# EAGLE schematic BE_SHIELD (EAGLE 6.3)

## Sheet 1 of 5
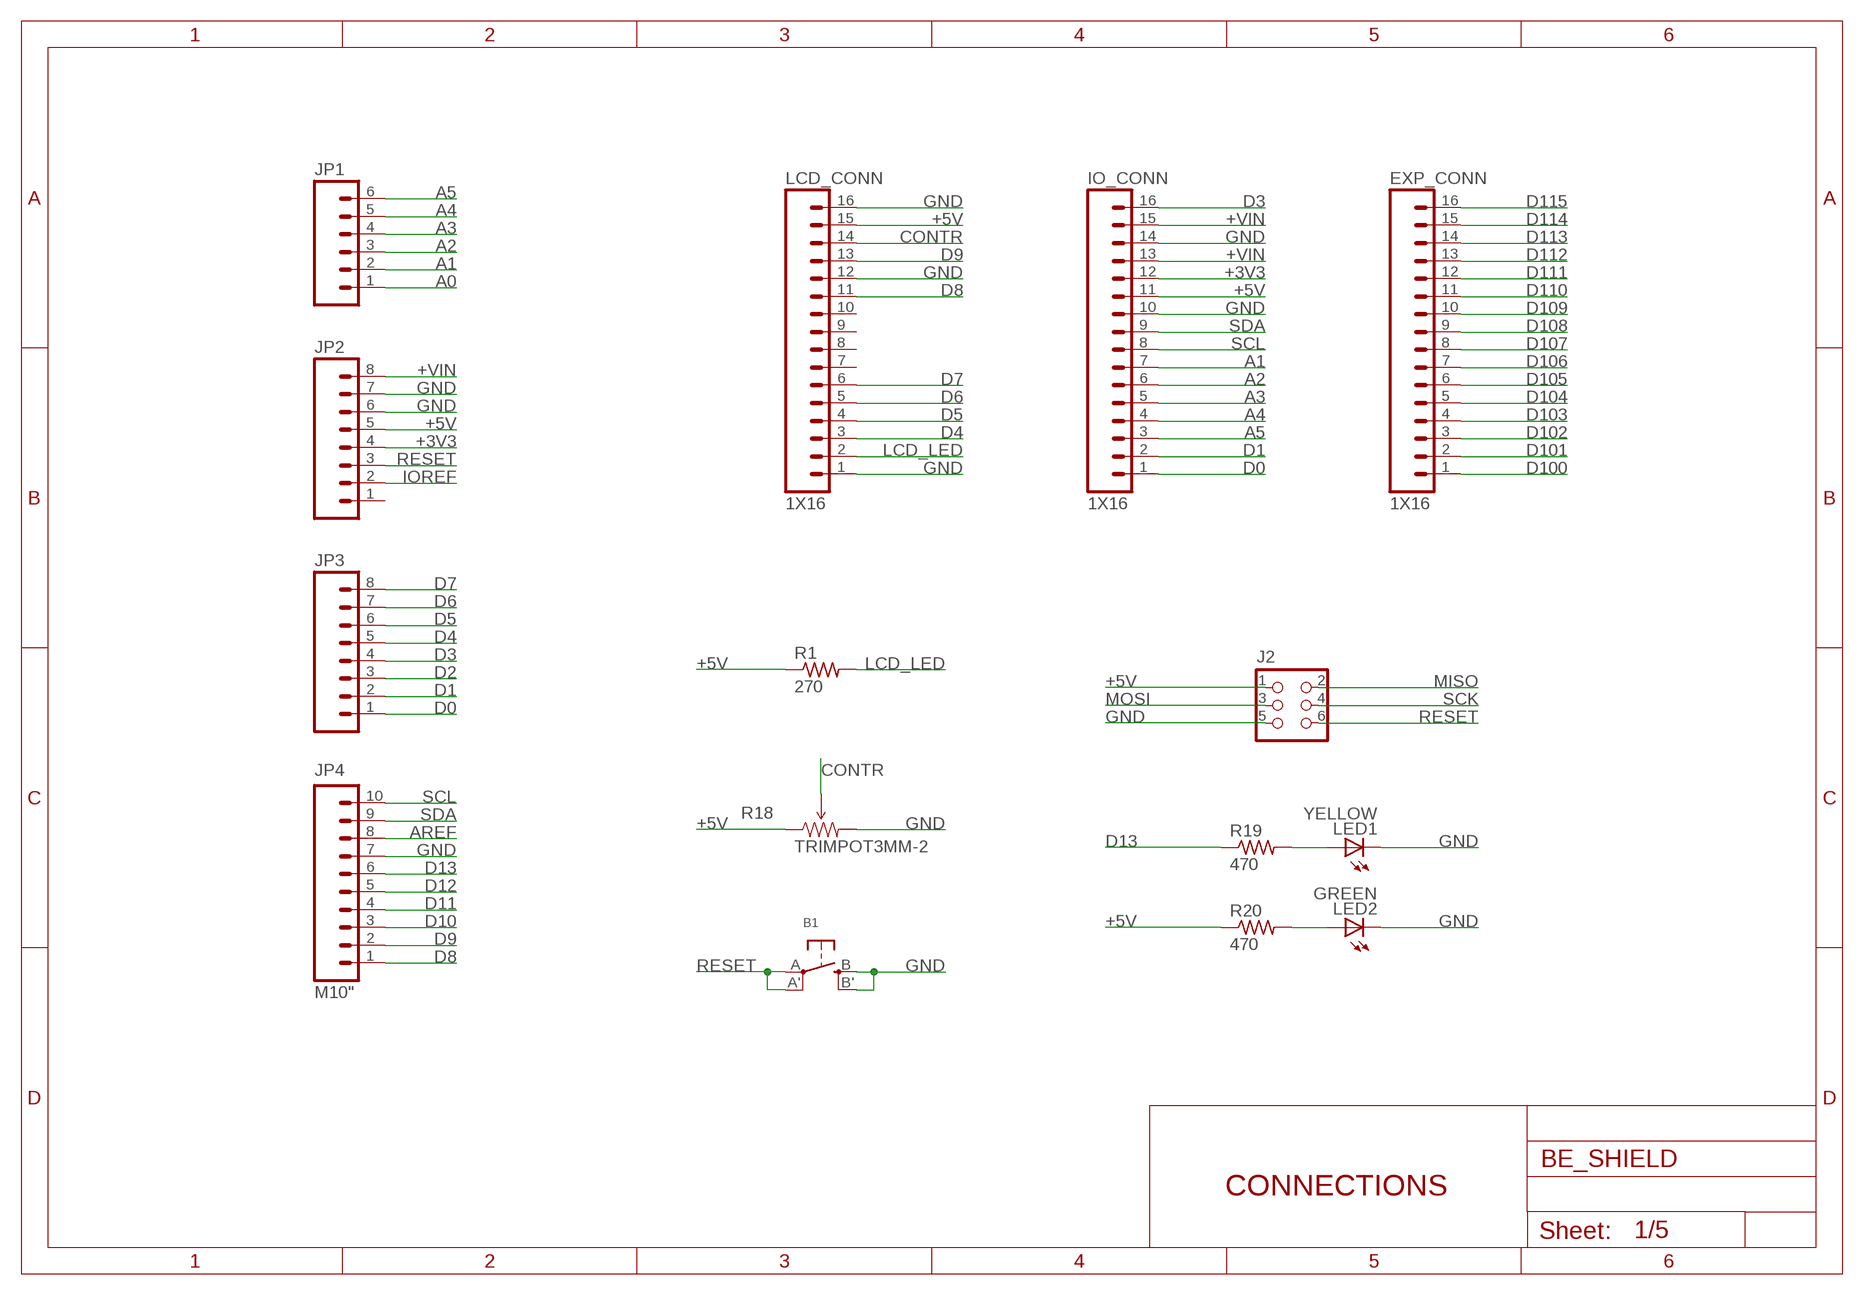
[diagram p0: schematic, sheet 1]

### Parts
B1  SWITCH_TACT_SMT  [EVQ-Q2]
EXP_CONN  1X16  [1X16_SMD]
IO_CONN  1X16  [1X16_SMD]
J2  CON_HEADER_2X03-SMD  [M2X3_SMD]
JP1  M06SIP  [1X06]
JP2  M081X08  [1X08]
JP3  M081X08  [1X08]
JP4  M10"  [1X10]
LCD_CONN  1X16  [1X16_SMD]
LED1  YELLOW  LEDCHIP-LED0805  [CHIP-LED0805]
LED2  GREEN  LEDCHIP-LED0805  [CHIP-LED0805]
R1  270  R-US_R0603  [R0603]
R18  TRIMPOT3MM-2  [TRIMPOT-3MM-2]
R19  470  R-US_R0603  [R0603]
R20  470  R-US_R0603  [R0603]

### Nets
+3V3: IO_CONN.12 JP2.4 ; also sheet 2,3,4
+5V [power]: IO_CONN.11 J2.1 JP2.5 LCD_CONN.15 R1.1 R18.1(CCW) R20.1 ; also sheet 2,4
+VIN: IO_CONN.13 IO_CONN.15 JP2.8 ; also sheet 5
A0: JP1.1 ; also sheet 2
A1: IO_CONN.7 JP1.2
A2: IO_CONN.6 JP1.3
A3: IO_CONN.5 JP1.4
A4: IO_CONN.4 JP1.5
A5: IO_CONN.3 JP1.6
AREF: JP4.8
CONTR: LCD_CONN.14 R18.2(WIPER)
D0: IO_CONN.1 JP3.1
D1: IO_CONN.2 JP3.2
D2: JP3.3 ; also sheet 2
D3: IO_CONN.16 JP3.4
D4: JP3.5 LCD_CONN.3
D5: JP3.6 LCD_CONN.4
D6: JP3.7 LCD_CONN.5
D7: JP3.8 LCD_CONN.6
D8: JP4.1 LCD_CONN.11
D9: JP4.2 LCD_CONN.13
D10: JP4.3 ; also sheet 3
D11: JP4.4
D12: JP4.5
D13: JP4.6 R19.1
D100: EXP_CONN.1 ; also sheet 4,5
D101: EXP_CONN.2 ; also sheet 4,5
D102: EXP_CONN.3 ; also sheet 4,5
D103: EXP_CONN.4 ; also sheet 4
D104: EXP_CONN.5 ; also sheet 4
D105: EXP_CONN.6 ; also sheet 4
D106: EXP_CONN.7 ; also sheet 4
D107: EXP_CONN.8 ; also sheet 4
D108: EXP_CONN.9 ; also sheet 4
D109: EXP_CONN.10 ; also sheet 4
D110: EXP_CONN.11 ; also sheet 4
D111: EXP_CONN.12 ; also sheet 4
D112: EXP_CONN.13 ; also sheet 4
D113: EXP_CONN.14 ; also sheet 4
D114: EXP_CONN.15 ; also sheet 4
D115: EXP_CONN.16 ; also sheet 4
GND: B1.B'(S1) B1.B(S) IO_CONN.10 IO_CONN.14 J2.5 JP2.6 JP2.7 JP4.7 LCD_CONN.1 LCD_CONN.12 LCD_CONN.16 LED1.C LED2.C R18.3(CW) ; also sheet 2,3,4,5
IOREF: JP2.2
LCD_LED: LCD_CONN.2 R1.2
MISO: J2.2 ; also sheet 2,3
MOSI: J2.3 ; also sheet 2,3
N$9: LED2.A R20.2
N$10: LED1.A R19.2
RESET: B1.A'(P1) B1.A(P) J2.6 JP2.3 ; also sheet 3,4
SCK: J2.4 ; also sheet 2,3
SCL: IO_CONN.8 JP4.10 ; also sheet 4
SDA: IO_CONN.9 JP4.9 ; also sheet 4
Unconnected: JP2.1 LCD_CONN.7 LCD_CONN.8 LCD_CONN.9 LCD_CONN.10

### Notes on the sheet
- CONNECTIONS

## Sheet 2 of 5
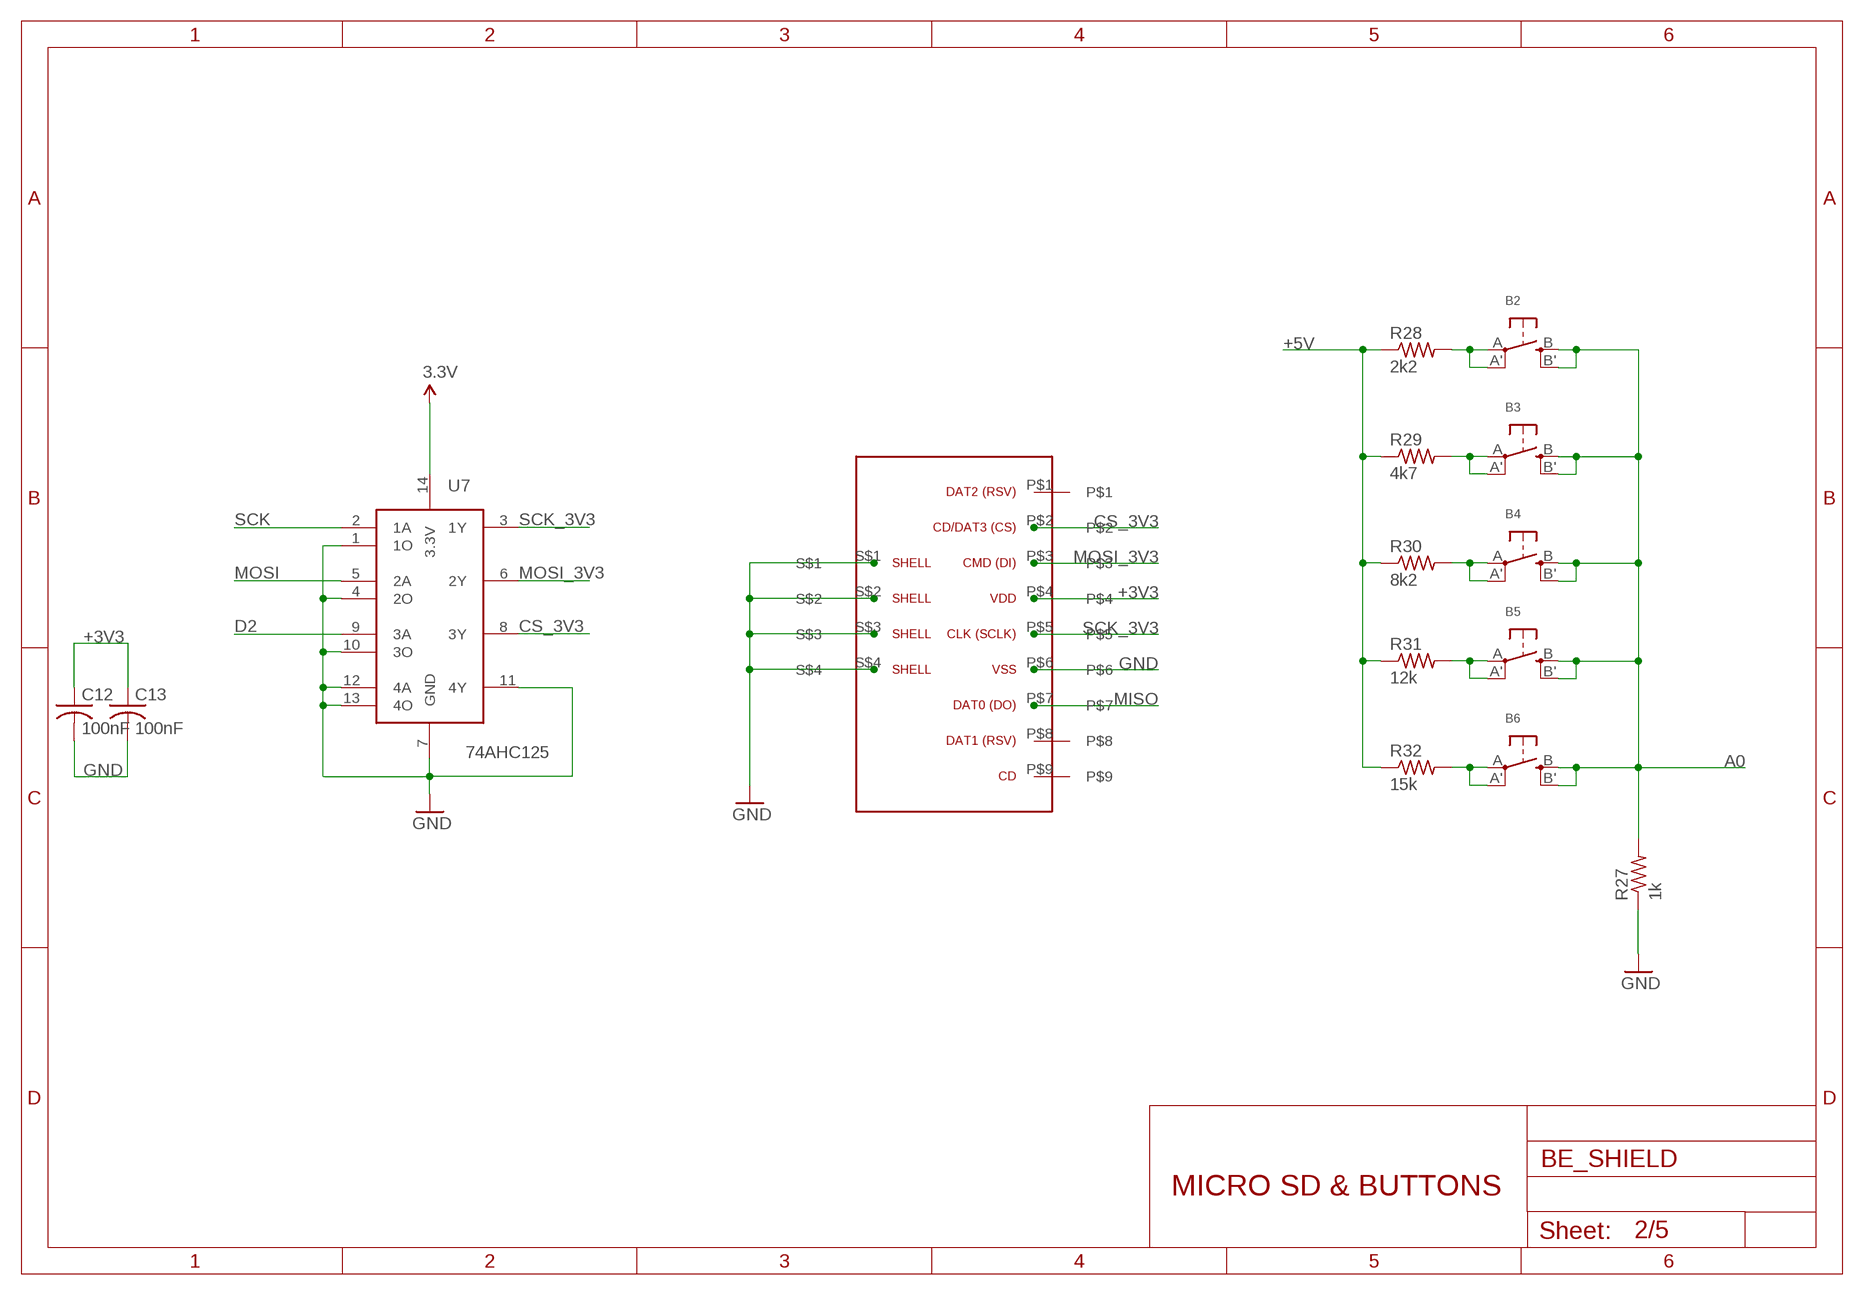
[diagram p1: schematic, sheet 2]

### Parts
B2  SWITCH_TACT_SMT  [EVQ-Q2]
B3  SWITCH_TACT_SMT  [EVQ-Q2]
B4  SWITCH_TACT_SMT  [EVQ-Q2]
B5  SWITCH_TACT_SMT  [EVQ-Q2]
B6  SWITCH_TACT_SMT  [EVQ-Q2]
C12  100nF  C-USC0603K  [C0603K]
C13  100nF  C-USC0603K  [C0603K]
R27  1k  R-US_R0603  [R0603]
R28  2k2  R-US_R0603  [R0603]
R29  4k7  R-US_R0603  [R0603]
R30  8k2  R-US_R0603  [R0603]
R31  12k  R-US_R0603  [R0603]
R32  15k  R-US_R0603  [R0603]
U7  74AHC125  74125_33V-SO  [SO014]
U$3  TFWF6-EBS1-1102  [TFWF6-EBS1-1102]

### Nets
+3V3: C12.1 C13.1 U7.14(3.3V) U$3.P$4 ; supply symbol labelled 3.3V ; also sheet 1,3,4
+5V [power]: R28.1 R29.1 R30.1 R31.1 R32.1 ; also sheet 1,4
A0: B2.B'(S1) B2.B(S) B3.B'(S1) B3.B(S) B4.B'(S1) B4.B(S) B5.B'(S1) B5.B(S) B6.B'(S1) B6.B(S) R27.2 ; also sheet 1
CS_3V3: U7.8(3Y) U$3.P$2
D2: U7.9(3A) ; also sheet 1
GND: C12.2 C13.2 R27.1 U7.1(1O) U7.4(2O) U7.7(GND) U7.10(3O) U7.11(4Y) U7.12(4A) U7.13(4O) U$3.P$6 U$3.S$1 U$3.S$2 U$3.S$3 U$3.S$4 ; also sheet 1,3,4,5
MISO: U$3.P$7 ; also sheet 1,3
MOSI: U7.5(2A) ; also sheet 1,3
MOSI_3V3: U7.6(2Y) U$3.P$3
N$15: B2.A'(P1) B2.A(P) R28.2
N$16: B3.A'(P1) B3.A(P) R29.2
N$17: B4.A'(P1) B4.A(P) R30.2
N$18: B5.A'(P1) B5.A(P) R31.2
N$19: B6.A'(P1) B6.A(P) R32.2
SCK: U7.2(1A) ; also sheet 1,3
SCK_3V3: U7.3(1Y) U$3.P$5
Unconnected: U$3.P$1 U$3.P$8 U$3.P$9

### Notes on the sheet
- MICRO SD & BUTTONS

## Sheet 3 of 5
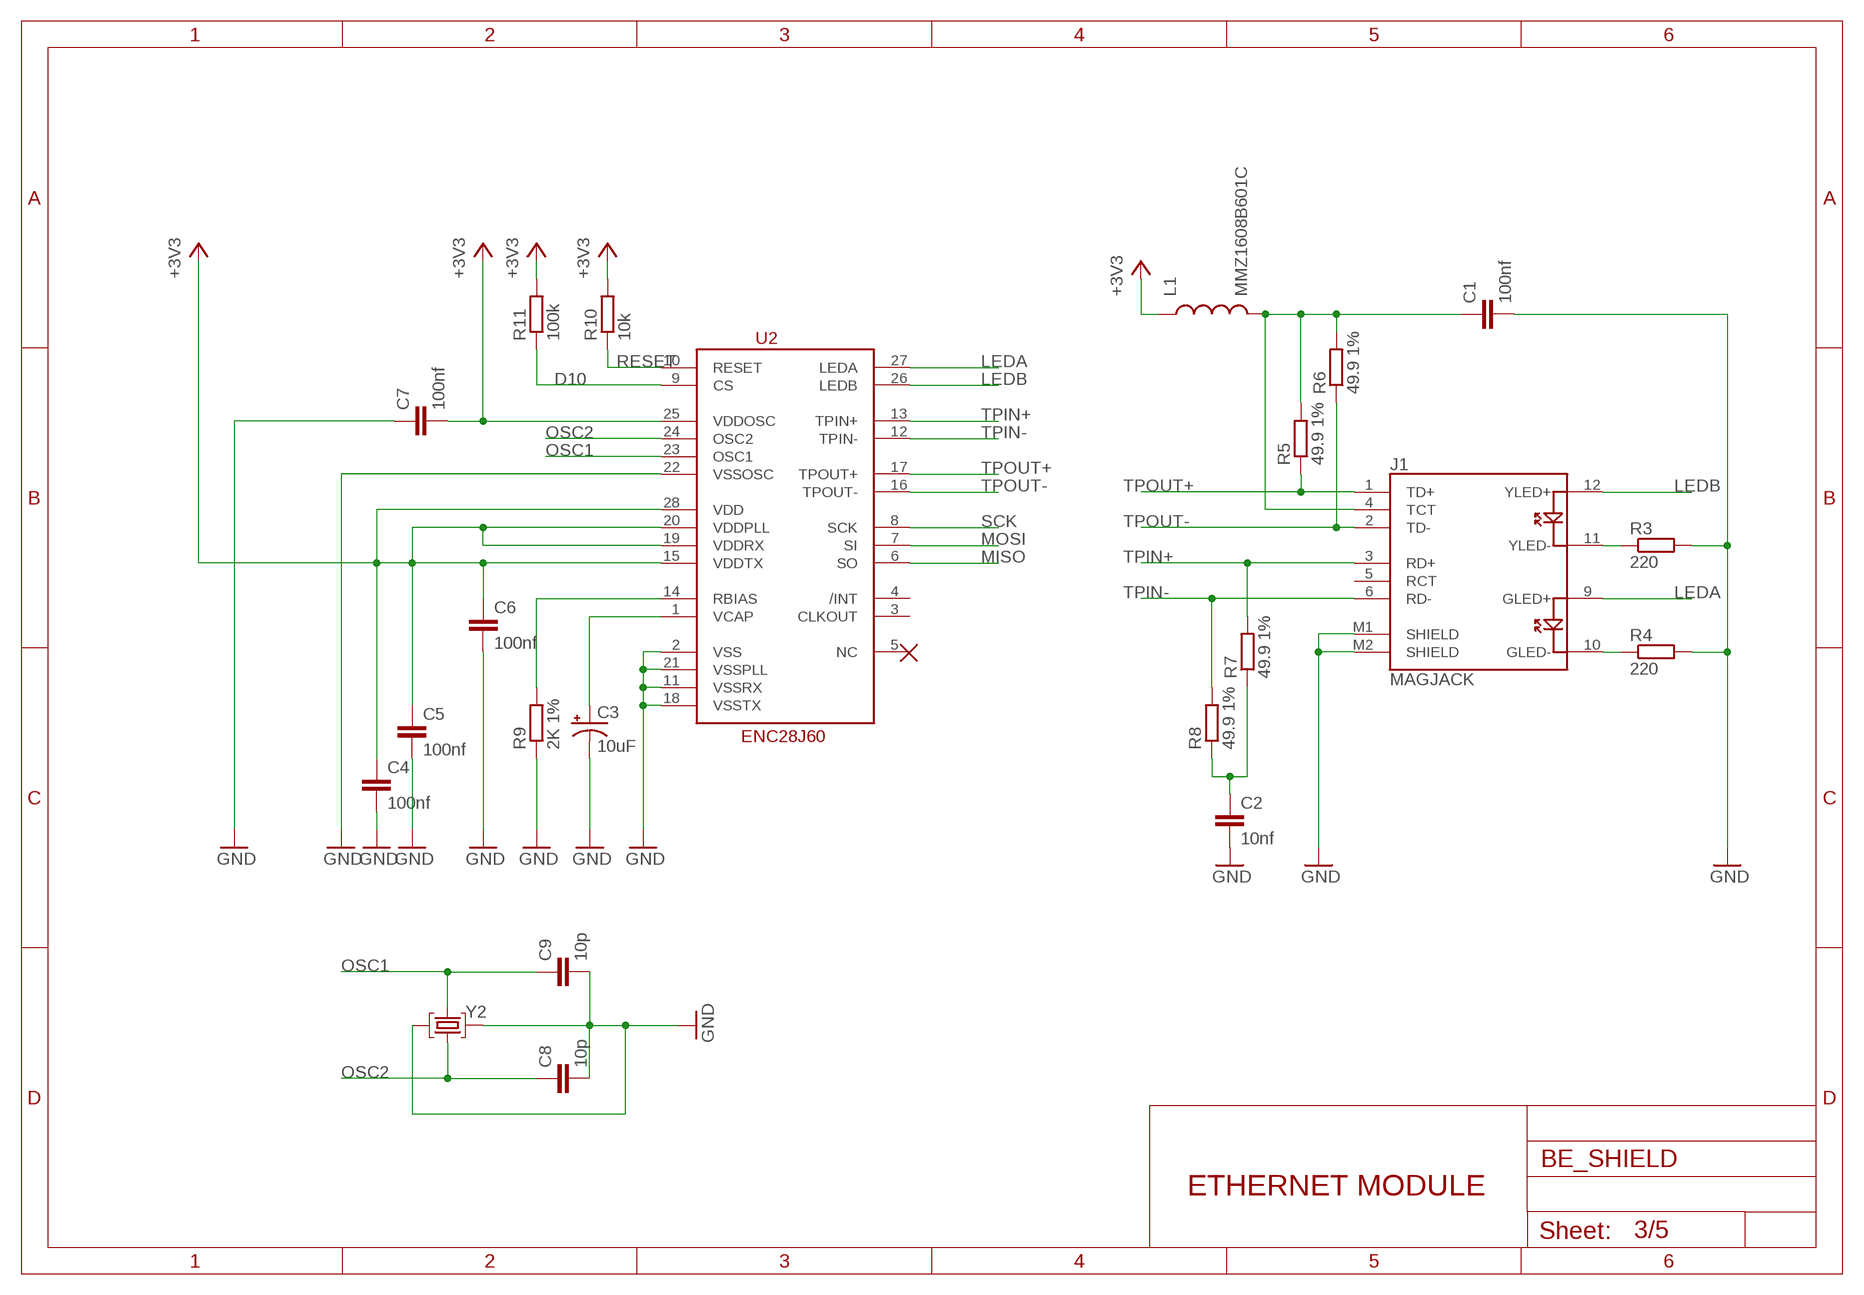
[diagram p2: schematic, sheet 3]

### Parts
C1  100nf  CAP0603-CAP  [0603-CAP]
C2  10nf  CAP0603-CAP  [0603-CAP]
C3  10uF  10UF-TANT  [EIA3216]
C4  100nf  CAP0603-CAP  [0603-CAP]
C5  100nf  CAP0603-CAP  [0603-CAP]
C6  100nf  CAP0603-CAP  [0603-CAP]
C7  100nf  CAP0603-CAP  [0603-CAP]
C8  10p  CAP0603-CAP  [0603-CAP]
C9  10p  CAP0603-CAP  [0603-CAP]
J1  MAGJACK  [MAGJACK]
L1  MMZ1608B601C  INDUCTOR0603  [0603]
R3  220  R-EU_R0603  [R0603]
R4  220  R-EU_R0603  [R0603]
R5  49.9 1%  R-EU_R0603  [R0603]
R6  49.9 1%  R-EU_R0603  [R0603]
R7  49.9 1%  R-EU_R0603  [R0603]
R8  49.9 1%  R-EU_R0603  [R0603]
R9  2K 1%  R-EU_R0603  [R0603]
R10  10k  R-EU_R0603  [R0603]
R11  100k  R-EU_R0603  [R0603]
U2  ENC28j60  ENC28J60  [SSOP28DB]
Y2  25MHz  CRYSTAL-3.2-2.5  [CRYSTAL-3.2-2.5]

### Nets
+3V3: C4.1 C5.1 C6.1 C7.2 L1.1 R10.2 R11.2 U2.15(VDDTX) U2.19(VDDRX) U2.20(VDDPLL) U2.25(VDDOSC) U2.28(VDD) ; also sheet 1,2,4
D10: R11.1 U2.9(CS) ; also sheet 1
GND: C1.2 C2.2 C3.C(-) C4.2 C5.2 C6.2 C7.1 C8.2 C9.2 J1.M1(SHIELD) J1.M2(SHIELD) R3.2 R4.2 R9.1 U2.2(VSS) U2.11(VSSRX) U2.18(VSSTX) U2.21(VSSPLL) U2.22(VSSOSC) Y2.2(GND) Y2.4(GND) ; also sheet 1,2,4,5
LEDA: J1.9(GLED+) U2.27(LEDA)
LEDB: J1.12(YLED+) U2.26(LEDB)
MISO: U2.6(SO) ; also sheet 1,2
MOSI: U2.7(SI) ; also sheet 1,2
N$1: C2.1 R7.1 R8.1
N$2: J1.11(YLED-) R3.1
N$3: R9.2 U2.14(RBIAS)
N$4: J1.10(GLED-) R4.1
N$5: C3.A(+) U2.1(VCAP)
N$11: C1.1 J1.4(TCT) L1.2 R5.2 R6.2
OSC1: C9.1 U2.23(OSC1) Y2.3(C2)
OSC2: C8.1 U2.24(OSC2) Y2.1(C1)
RESET: R10.1 U2.10(RESET) ; also sheet 1,4
SCK: U2.8(SCK) ; also sheet 1,2
TPIN+: J1.3(RD+) R7.2 U2.13(TPIN+)
TPIN-: J1.6(RD-) R8.2 U2.12(TPIN-)
TPOUT+: J1.1(TD+) R5.1 U2.17(TPOUT+)
TPOUT-: J1.2(TD-) R6.1 U2.16(TPOUT-)
Unconnected: J1.5(RCT) U2.3(CLKOUT) U2.4(/INT) U2.5(NC)

### Notes on the sheet
- ETHERNET MODULE

## Sheet 4 of 5
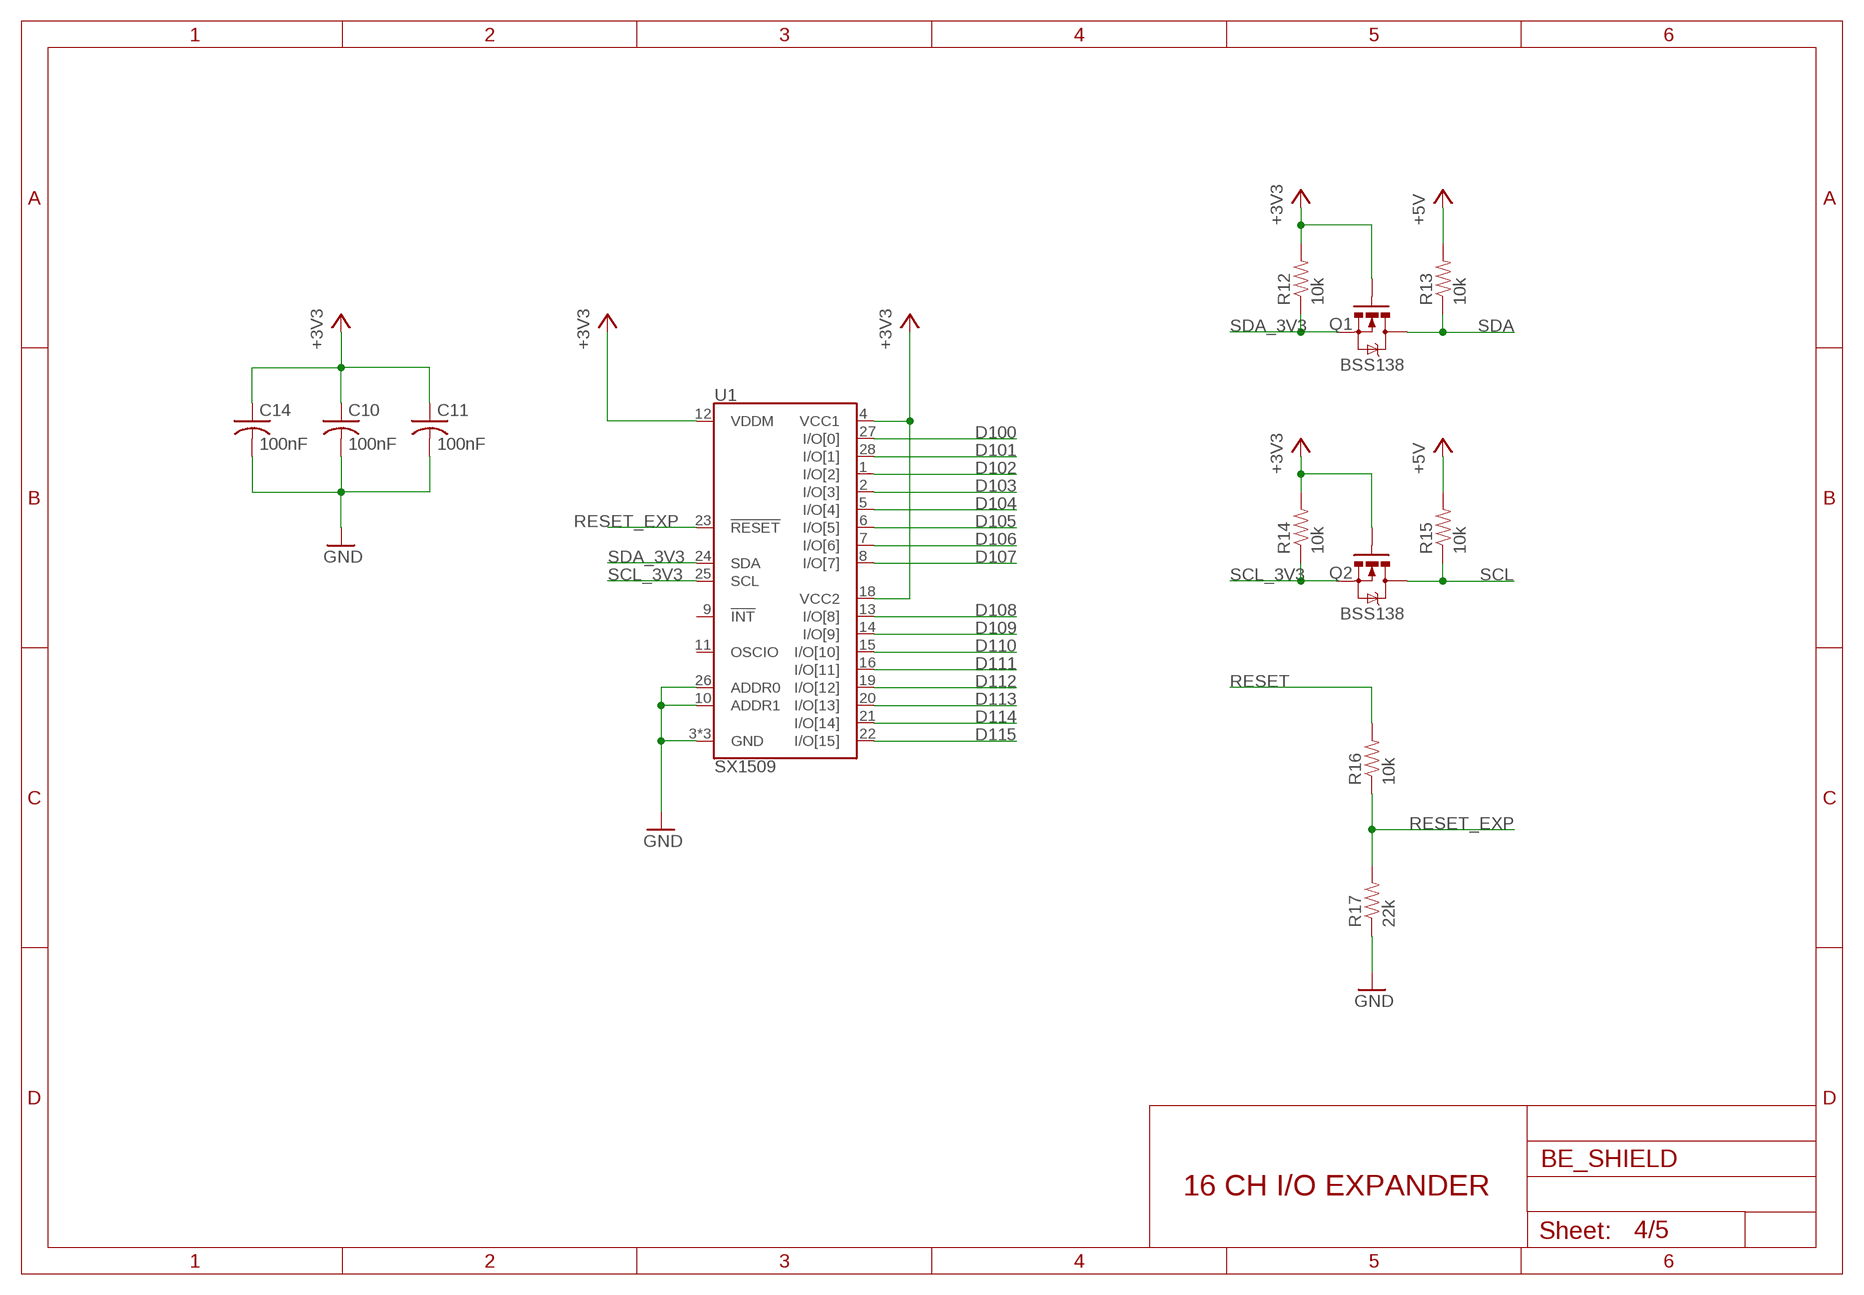
[diagram p3: schematic, sheet 4]

### Parts
C10  100nF  C-USC0603K  [C0603K]
C11  100nF  C-USC0603K  [C0603K]
C14  100nF  C-USC0603K  [C0603K]
Q1  BSS138  MOSFET-NCHANNELSMD  [SOT23-3]
Q2  BSS138  MOSFET-NCHANNELSMD  [SOT23-3]
R12  10k  RESISTOR0603-RES  [0603-RES]
R13  10k  RESISTOR0603-RES  [0603-RES]
R14  10k  RESISTOR0603-RES  [0603-RES]
R15  10k  RESISTOR0603-RES  [0603-RES]
R16  10k  RESISTOR0603-RES  [0603-RES]
R17  22k  RESISTOR0603-RES  [0603-RES]
U1  SX1509  [QFN-28]

### Nets
+3V3: C10.1 C11.1 C14.1 Q1.1(G) Q2.1(G) R12.2 R14.2 U1.4(VCC1) U1.12(VDDM) U1.18(VCC2) ; also sheet 1,2,3
+5V [power]: R13.2 R15.2 ; also sheet 1,2
D100: U1.27(I/O[0]) ; also sheet 1,5
D101: U1.28(I/O[1]) ; also sheet 1,5
D102: U1.1(I/O[2]) ; also sheet 1,5
D103: U1.2(I/O[3]) ; also sheet 1
D104: U1.5(I/O[4]) ; also sheet 1
D105: U1.6(I/O[5]) ; also sheet 1
D106: U1.7(I/O[6]) ; also sheet 1
D107: U1.8(I/O[7]) ; also sheet 1
D108: U1.13(I/O[8]) ; also sheet 1
D109: U1.14(I/O[9]) ; also sheet 1
D110: U1.15(I/O[10]) ; also sheet 1
D111: U1.16(I/O[11]) ; also sheet 1
D112: U1.19(I/O[12]) ; also sheet 1
D113: U1.20(I/O[13]) ; also sheet 1
D114: U1.21(I/O[14]) ; also sheet 1
D115: U1.22(I/O[15]) ; also sheet 1
GND: C10.2 C11.2 C14.2 R17.1 U1.3(GND) U1.10(ADDR1) U1.17(GND) U1.26(ADDR0) U1.29(GND) ; also sheet 1,2,3,5
RESET: R16.2 ; also sheet 1,3
RESET_EXP: R16.1 R17.2 U1.23(!RESET)
SCL: Q2.3(D) R15.1 ; also sheet 1
SCL_3V3: Q2.2(S) R14.1 U1.25(SCL)
SDA: Q1.3(D) R13.1 ; also sheet 1
SDA_3V3: Q1.2(S) R12.1 U1.24(SDA)
Unconnected: U1.9(!INT) U1.11(OSCIO)

### Notes on the sheet
- 16 CH I/O EXPANDER

## Sheet 5 of 5
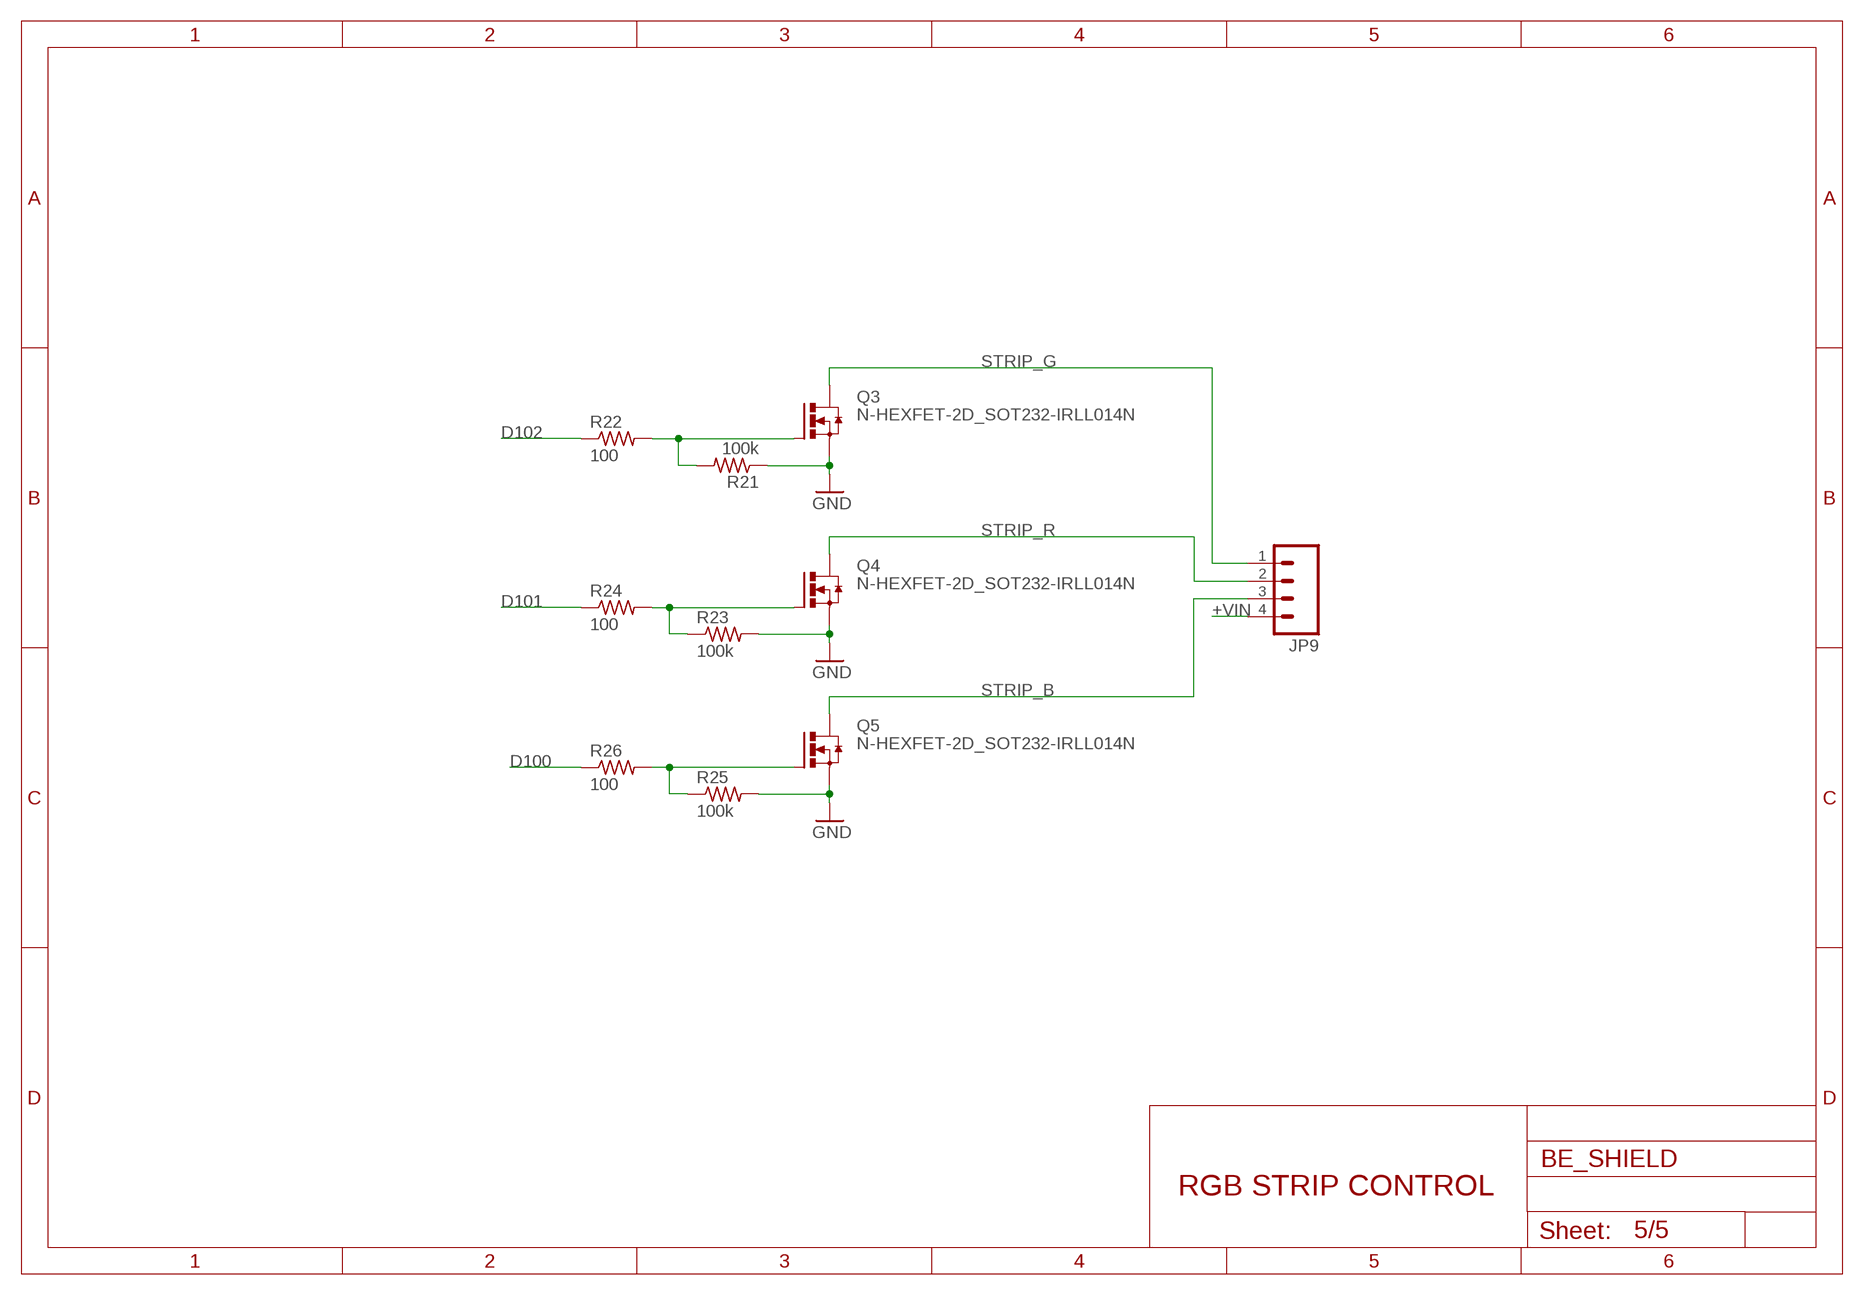
[diagram p4: schematic, sheet 5]

### Parts
JP9  M04SMD  [1X04-SMD]
Q3  N-HEXFET-2D_SOT232-IRLL014N  [SOT223]
Q4  N-HEXFET-2D_SOT232-IRLL014N  [SOT223]
Q5  N-HEXFET-2D_SOT232-IRLL014N  [SOT223]
R21  100k  R-US_R0603  [R0603]
R22  100  R-US_R0603  [R0603]
R23  100k  R-US_R0603  [R0603]
R24  100  R-US_R0603  [R0603]
R25  100k  R-US_R0603  [R0603]
R26  100  R-US_R0603  [R0603]

### Nets
+VIN: JP9.4 ; also sheet 1
D100: R26.1 ; also sheet 1,4
D101: R24.1 ; also sheet 1,4
D102: R22.1 ; also sheet 1,4
GND: Q3.3(S) Q4.3(S) Q5.3(S) R21.1 R23.2 R25.2 ; also sheet 1,2,3,4
N$8: Q5.1(G) R25.1 R26.2
N$13: Q3.1(G) R21.2 R22.2
N$14: Q4.1(G) R23.1 R24.2
STRIP_B: JP9.3 Q5.2(D) Q5.4(D)
STRIP_G: JP9.1 Q3.2(D) Q3.4(D)
STRIP_R: JP9.2 Q4.2(D) Q4.4(D)

### Notes on the sheet
- RGB STRIP CONTROL

## Library data of the parts
B1-B6 = microbuilder:SWITCH_TACT_SMT: SMT Tact Switches 6x6mm - Digikey: P12940SCT-ND KMR2 (4.6x2.8mm) - Digikey: 401-1426-1-ND EVQ-PQHB55 - Light Touch, 160GF (4.5x4.5mm) - Digikey: P8090SCT-ND
C1 C2 C4-C9 = SparkFun-Capacitors:CAP: Capacitor Standard 0603 ceramic capacitor, and 0.1" leaded capacitor.
C3 = SparkFun-Capacitors:10UF-TANT: 10uF Tantalum SMT CAP-00811- 16V 10% (EIA-3216); PROD_ID: CAP-00811
C10-C14 = rcl:C-US: CAPACITOR, American symbol
EXP_CONN IO_CONN LCD_CONN = smARtMAKER:1X16
J1 = SparkFun-Connectors:MAGJACK: RJ-45 with LEDs
J2 = dp_devices:CON_HEADER_2X03
JP1 = SparkFun-Connectors:M06: Header 6 Standard 6-pin 0.1" header. Use with straight break away headers (SKU : PRT-00116), right angle break away headers (PRT-00553), swiss pins (PRT-00743), machine pins (PRT-00117), and female headers (PRT-00115). Molex polarized connector foot print use with SKU : PRT-08094 with associated crimp pins and housings. NOTES ON THE VARIANTS LOCK and LOCK_LONGPADS... This footprint was designed to help hold the alignment of a through-hole component (i.e. 6-pin header) while soldering it into place. You may notice that each hole has been shifted either up or down by 0.005 of an inch from it's more standard position (which is a perfectly straight line). This slight alteration caused the pins (the squares in the middle) to touch the edges of the holes. Because they are alternating, it causes a "brace" to hold the component in place. 0.005 has proven to be the perfect amount of "off-center" position when using our standard breakaway headers. Although looks a little odd when you look at the bare footprint, once you have a header in there, the alteration is very hard to notice. Also,if you push a header all the way into place, it is covered up entirely on the bottom side. This idea of altering the position of holes to aid alignment will be further integrated into the Sparkfun Library for other footprints. It can help hold any component with 3 or more connection pins.
JP2 JP3 = SparkFun-Connectors:M08: Header 8 Standard 8-pin 0.1" header. Use with straight break away headers (SKU : PRT-00116), right angle break away headers (PRT-00553), swiss pins (PRT-00743), machine pins (PRT-00117), and female headers (PRT-00115).
JP4 = SparkFun-Connectors:M10: Header 10 Standard 10-pin 0.1" header. Use with straight break away headers (SKU : PRT-00116), right angle break away headers (PRT-00553), swiss pins (PRT-00743), machine pins (PRT-00117), and female headers (PRT-00115).
JP9 = SparkFun-Connectors:M04: Header 4 Standard 4-pin 0.1" header. Use with straight break away headers (SKU : PRT-00116), right angle break away headers (PRT-00553), swiss pins (PRT-00743), machine pins (PRT-00117), and female headers (PRT-00115). Molex polarized connector foot print use with SKU : PRT-08231 with associated crimp pins and housings. 1MM SMD Version SKU: PRT-10208
L1 = SparkFun-Passives:INDUCTOR: Inductors Basic Inductor/Choke - 0603 and 1206. Footprints are not proven and vary greatly between part numbers. SRN6045- 33uH, 20% 1.4A
LED1 LED2 = led:LED: LED OSRAM: - CHIPLED LG R971, LG N971, LY N971, LG Q971, LY Q971, LO R971, LY R971 LH N974, LH R974 LS Q976, LO Q976, LY Q976 LO Q996 - Hyper CHIPLED LW Q18S LB Q993, LB Q99A, LB R99A - SideLED LS A670, LO A670, LY A670, LG A670, LP A670 LB A673, LV A673, LT A673, LW A673 LH A674 LY A675 LS A676, LA A676, LO A676, LY A676, LW A676 LS A679, LY A679, LG A679 - Hyper Micro SIDELED® LS Y876, LA Y876, LO Y876, LY Y876 LT Y87S - SmartLED LW L88C, LW L88S LB L89C, LB L89S, LG L890 LS L89K, LO L89K, LY L89K LS L896, LA L896, LO L896, LY L896 - TOPLED LS T670, LO T670, LY T670, LG T670, LP T670 LSG T670, LSP T670, LSY T670, LOP T670, LYG T670 LG T671, LOG T671, LSG T671 LB T673, LV T673, LT T673, LW T673 LH T674 LS T676, LA T676, LO T676, LY T676, LB T676, LH T676, LSB T676, LW T676 LB T67C, LV T67C, LT T67C, LS T67K, LO T67K, LY T67K, LW E67C LS E67B, LA E67B, LO E67B, LY E67B, LB E67C, LV E67C, LT E67C LW T67C LS T679, LY T679, LG T679 LS T770, LO T770, LY T770, LG T770, LP T770 LB T773, LV T773, LT T773, LW T773 LH T774 LS E675, LA E675, LY E675, LS T675 LS T776, LA T776, LO T776, LY T776, LB T776 LHGB T686 LT T68C, LB T68C - Hyper Mini TOPLED® LB M676 - Mini TOPLED Santana® LG M470 LS M47K, LO M47K, LY M47K Source: http://www.osram.convergy.de LUXEON: - LUMILED® LXK2-PW12-R00, LXK2-PW12-S00, LXK2-PW14-U00, LXK2-PW14-V00 LXK2-PM12-R00, LXK2-PM12-S00, LXK2-PM14-U00 LXK2-PE12-Q00, LXK2-PE12-R00, LXK2-PE12-S00, LXK2-PE14-T00, LXK2-PE14-U00 LXK2-PB12-K00, LXK2-PB12-L00, LXK2-PB12-M00, LXK2-PB14-N00, LXK2-PB14-P00, LXK2-PB14-Q00 LXK2-PR12-L00, LXK2-PR12-M00, LXK2-PR14-Q00, LXK2-PR14-R00 LXK2-PD12-Q00, LXK2-PD12-R00, LXK2-PD12-S00 LXK2-PH12-R00, LXK2-PH12-S00 LXK2-PL12-P00, LXK2-PL12-Q00, LXK2-PL12-R00 Source: www.luxeon.com KINGBRIGHT: KA-3528ASYC Source: www.kingbright.com
Q1 Q2 = SparkFun-DiscreteSemi:MOSFET-NCHANNEL: Generic NMOS footprint
Q3-Q5 = transistor-power:N-HEXFET-2D_?-*: HEXFET® Power MOSFET 2 Drain connects http://www.irf.com/product-info/datasheets/data/irll014n.pdf
R1 R19-R32 = resistor:R-US_: RESISTOR, American symbol
R3-R11 = rcl:R-EU_: RESISTOR, European symbol
R12-R17 = SparkFun-Passives:RESISTOR: Resistor Basic schematic elements and footprints for 0603, 1206, and PTH resistors.
R18 = SparkFun-Electromechanical:TRIMPOT: Various small potentiometers for "set-and-forget" applications
U1 = SparkFun-DigitalIC:SX1509
U2 = SparkFun-DigitalIC:ENC28J60: Microchip SPI 10Base ethernet IC
U7 = CH_logic:74125_33V
U$3 = smARtDUINO:TFWF6-EBS1-1102: microSD TF card connector
Y2 = SmartPrj:CRYSTAL-3.2-2.5

## Net classes
1 power: width 0.254 mm, drill 0.254 mm, clearance 0.254 mm